# EAGLE design kegboard-coaster-alt (EAGLE 6.4)
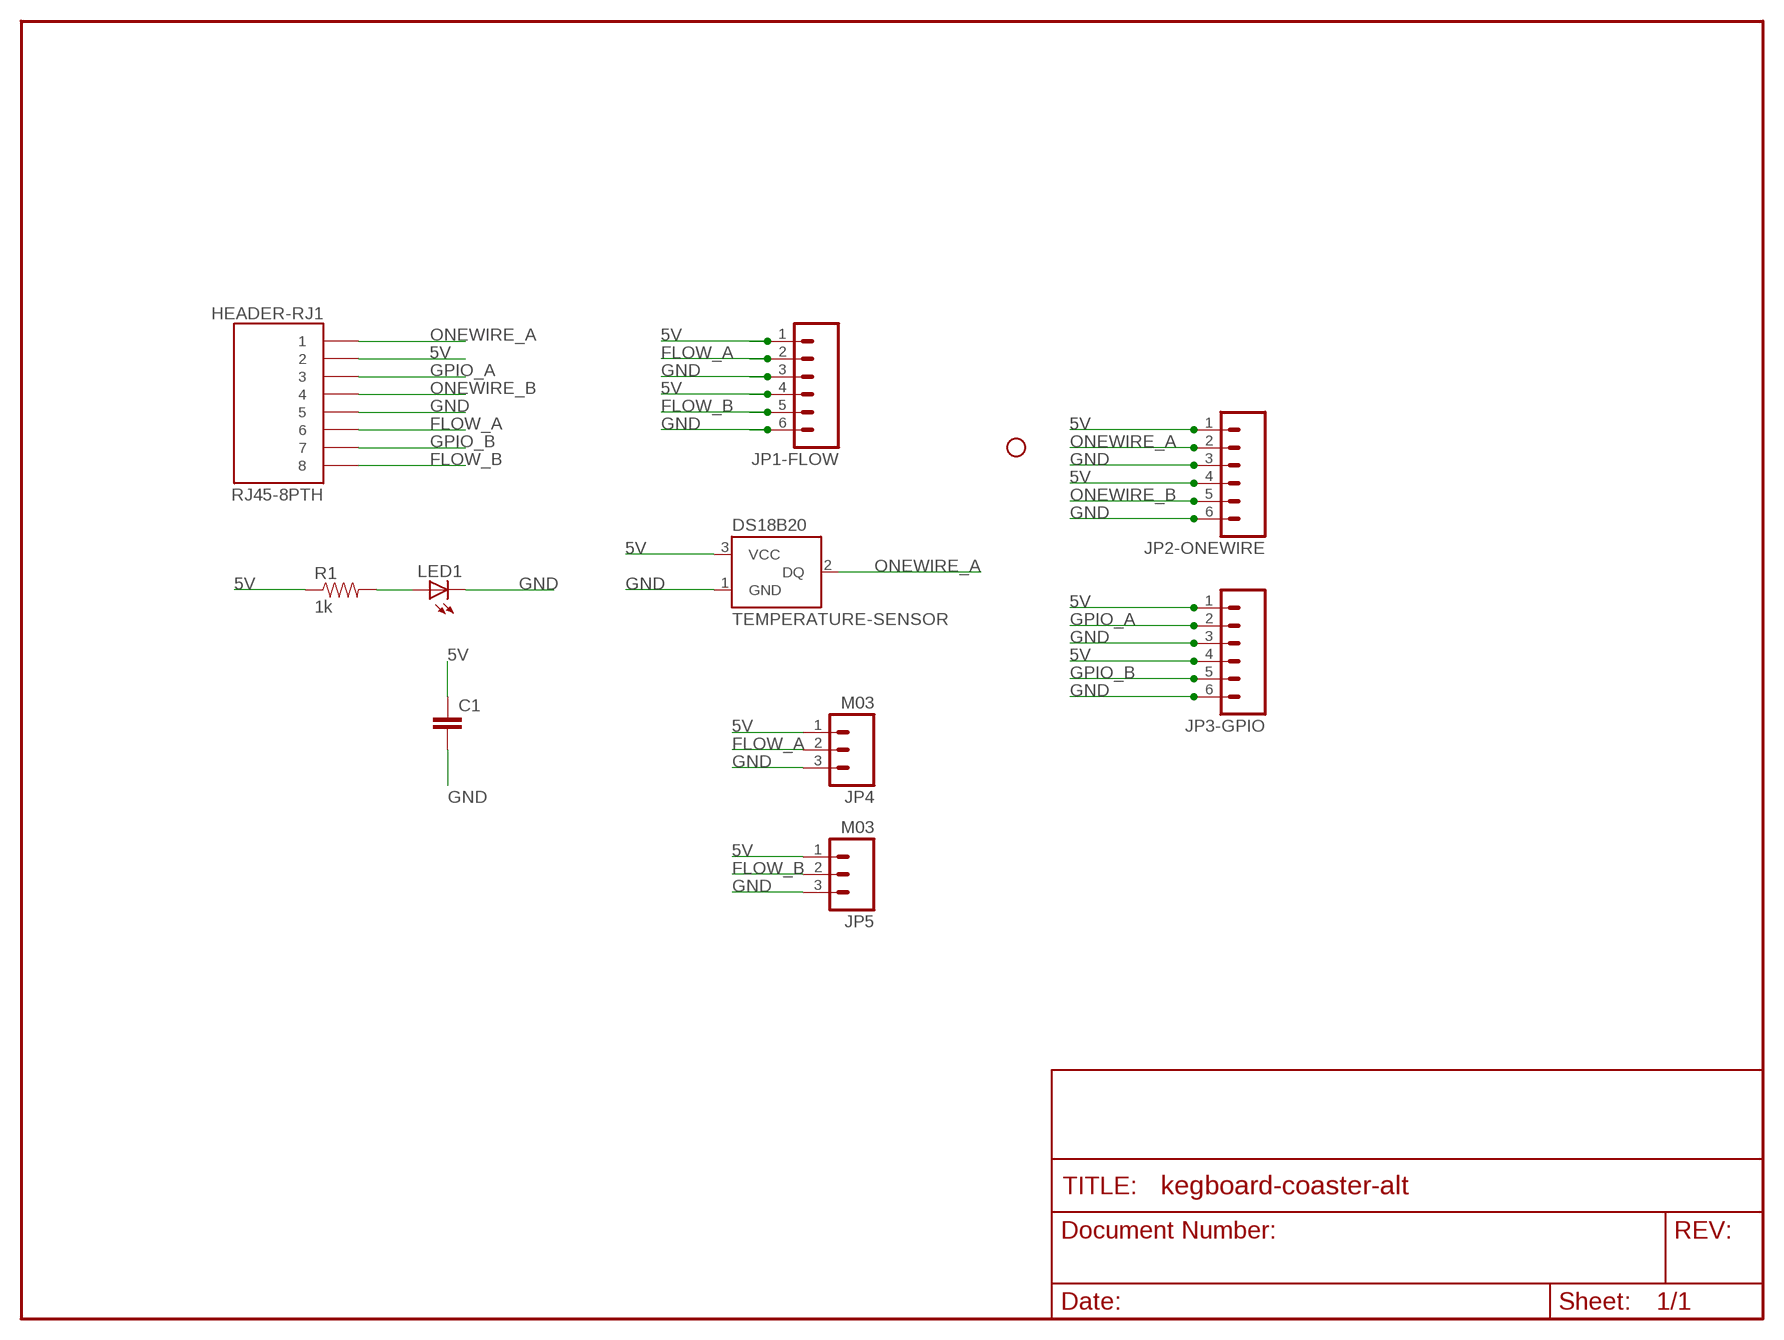
[diagram p0: schematic, sheet 1]

## Parts
C1  CAPPTH2  [CAP-PTH-SMALL2]
HEADER-RJ1  RJ45-8PTH  [RJ45-8]
JP1-FLOW  M063.5MM-6  [SCREWTERMINAL-3.5MM-6]
JP2  STAND-OFF  [STAND-OFF]
JP2-ONEWIRE  M063.5MM-6  [SCREWTERMINAL-3.5MM-6]
JP3-GPIO  M063.5MM-6  [SCREWTERMINAL-3.5MM-6]
JP4  M03  [53324-0360]
JP5  M03  [53324-0360]
LED1  LED3MM  [LED3MM]
R1  1k  RESISTORPTH1  [AXIAL-0.3]
U$1  TEMPERATURE-SENSOR  [TO-92]

## Nets
5V: C1.1 HEADER-RJ1.2 JP1-FLOW.1 JP1-FLOW.4 JP2-ONEWIRE.1 JP2-ONEWIRE.4 JP3-GPIO.1 JP3-GPIO.4 JP4.1 JP5.1 R1.P$1 U$1.3(VCC)
FLOW_A: HEADER-RJ1.6 JP1-FLOW.2 JP4.2
FLOW_B: HEADER-RJ1.8 JP1-FLOW.5 JP5.2
GND: C1.2 HEADER-RJ1.5 JP1-FLOW.3 JP1-FLOW.6 JP2-ONEWIRE.3 JP2-ONEWIRE.6 JP3-GPIO.3 JP3-GPIO.6 JP4.3 JP5.3 LED1.K(C) U$1.1(GND)
GPIO_A: HEADER-RJ1.3 JP3-GPIO.2
GPIO_B: HEADER-RJ1.7 JP3-GPIO.5
N$1: LED1.A R1.P$2
ONEWIRE_A: HEADER-RJ1.1 JP2-ONEWIRE.2 U$1.2(DQ)
ONEWIRE_B: HEADER-RJ1.4 JP2-ONEWIRE.5

## Library data of the parts
C1 = SparkFun-20100412:CAP: Capacitor Standard 0603 ceramic capacitor, and 0.1" leaded capacitor.
HEADER-RJ1 = SparkFun:RJ45-8: RJ45 Jack Simple RJ45, 8-pin connection - connector for common Cat5, Cat5e, and Cat6 Ethernet cables. Footprint not yet proven in production. Connector sku is PRT-00643; Breakout PCB sku is BOB-00716.
JP1-FLOW JP2-ONEWIRE JP3-GPIO = SparkFun:M06: Header 6 Standard 6-pin 0.1" header. Use with straight break away headers (SKU : PRT-00116), right angle break away headers (PRT-00553), swiss pins (PRT-00743), machine pins (PRT-00117), and female headers (PRT-00115). Molex polarized connector foot print use with SKU : PRT-08094 with associated crimp pins and housings. NOTES ON THE VARIANTS LOCK and LOCK_LONGPADS... This footprint was designed to help hold the alignment of a through-hole component (i.e. 6-pin header) while soldering it into place. You may notice that each hole has been shifted either up or down by 0.005 of an inch from it's more standard position (which is a perfectly straight line). This slight alteration caused the pins (the squares in the middle) to touch the edges of the holes. Because they are alternating, it causes a "brace" to hold the component in place. 0.005 has proven to be the perfect amount of "off-center" position when using our standard breakaway headers. Although looks a little odd when you look at the bare footprint, once you have a header in there, the alteration is very hard to notice. Also, if you push a header all the way into place, it is covered up entirely on the bottom side. This idea of altering the position of holes to aid alignment will be further integrated into the Sparkfun Library for other footprints. It can help hold any component with 3 or more connection pins.
JP2 = SparkFun-20100412:STAND-OFF: Stand Off This is the mechanical footprint for a #4 phillips button head screw. Use the keepout ring to avoid running the screw head into surrounding components. SKU : PRT-00447
JP4 JP5 = mikey-molex:M03
LED1 = SparkFun:LED: LEDs Standard schematic elements and footprints for 5mm, 3mm, 1206, and 0603 sized LEDs. 5mm - Spark Fun Electronics SKU : COM-00529 (and others)
R1 = SparkFun:RESISTOR: Resistor Basic schematic elements and footprints for 0603, 1206, and PTH 1/10th watt (small) resistors.
U$1 = geoffculp:TEMPERATURE-SENSOR

## Board
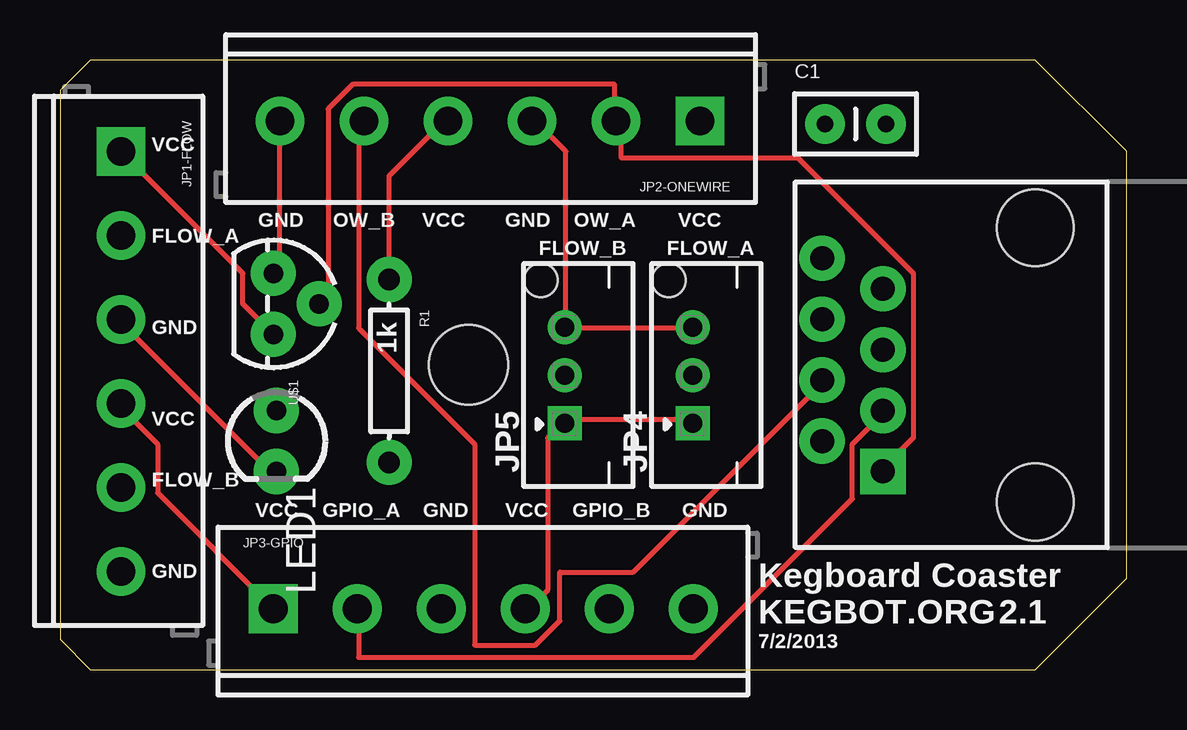
[diagram p1: board, top side]
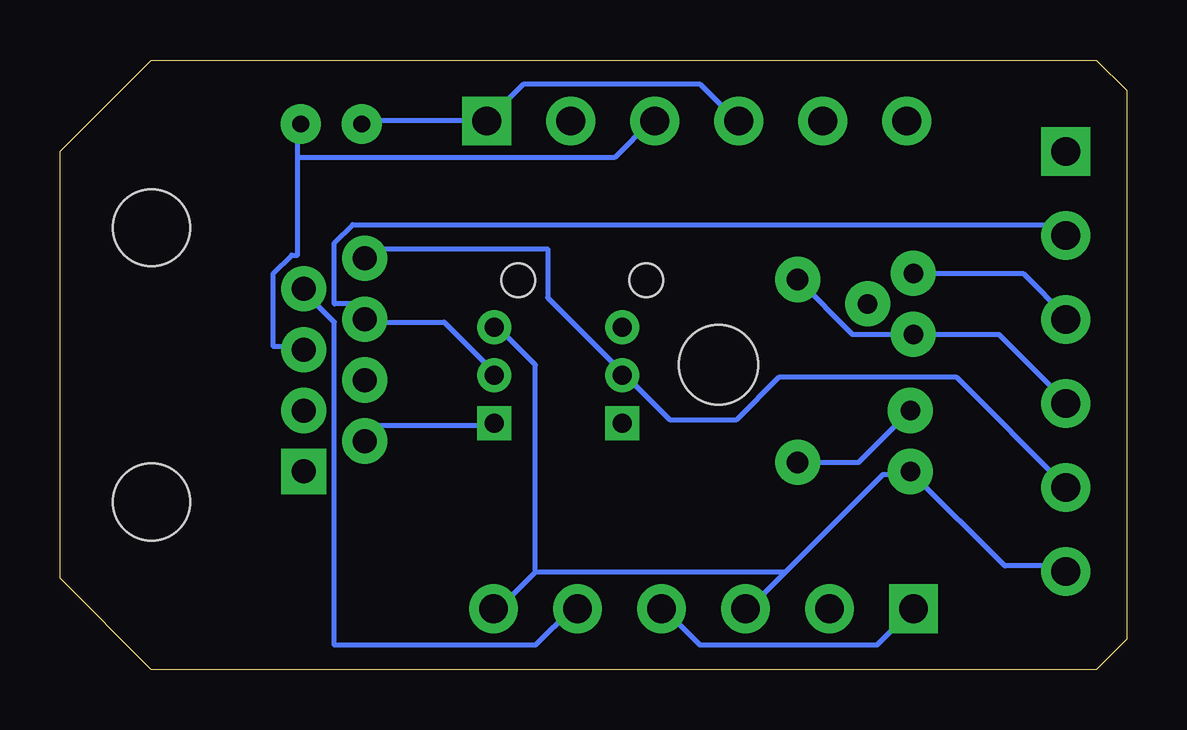
[diagram p2: board, bottom side, seen from below]

Size 44.45 x 25.4 mm. Coordinates in mm from the lower left corner, seen from the top.
Outline: 0,1.27 1.27,0 40.64,0 44.45,3.81 44.45,21.59 40.64,25.4 1.27,25.4 0,24.13 0,1.27
Copper layers (1*16): Top 0.035mm / dielectric 1.5mm / Bottom 0.035mm
Design rules "SparkFun": minimum track width 8mil, minimum drill 20mil, track to track 8mil, track to pad 8mil, pad to pad 8mil, via to via 8mil, smd to smd 8mil, copper to edge 10mil, drill to drill 8mil, minimum pad ring 12mil, minimum via ring 10mil, stop-mask expansion 4mil, vias tented up to drill 25mil, thermal gap 10mil

### Footprints (pad centres in the part's own frame; a part is rotated, then mirrored left to right if it is on the bottom)
CAP-PTH-SMALL2 = drill 0.7 pad 1.651: 1 0,0; 2 2.54,0
RJ45-8 = drill 1 pad 1.88 square: 1 -4.445,6.35 | drill 1 pad 1.88: 2 -3.175,8.89; 3 -1.905,6.35; 4 -0.635,8.89; 5 0.635,6.35; 6 1.905,8.89; 7 3.175,6.35; 8 4.445,8.89 | hole 3.2: -5.715,0; 5.715,0
SCREWTERMINAL-3.5MM-6 = drill 1.2 pad 2.032 square: 1 0,0 | drill 1.2 pad 2.032: 2 3.5,0; 3 7,0; 4 10.5,0; 5 14,0; 6 17.5,0
STAND-OFF = hole 3.302: 0,0
53324-0360 = drill 0.8 square: 1 2.65,2.85 | drill 0.8: 2 4.65,2.85; 3 6.65,2.85 | hole 1.4: 8.6,3.85
LED3MM = drill 0.813 pad 1.88: A -1.27,0; K 1.27,0
AXIAL-0.3 = drill 0.9 pad 1.88: P$1 -3.81,0; P$2 3.81,0
TO-92 = drill 0.813 pad 1.88: 1 -1.27,0; 2 0,1.905; 3 1.27,0

### Placement (x,y rotation side)
C1  31.88,22.73 0 top
HEADER-RJ1  40.64,12.7 90 top
JP1-FLOW  2.54,21.59 270 top
JP2  17.02,12.7 0 top
JP2-ONEWIRE  26.67,22.86 180 top
JP3-GPIO  8.89,2.54 0 top
JP4  29.21,7.62 90 top
JP5  23.88,7.62 90 top
LED1  9.02,9.53 270 top
R1  13.72,12.45 270 top
U$1  8.89,15.24 270 top

### Tracks (layer width: path | path; a pad name or v marks a point on that pad's centre or on a via)
5V
  Top 0.203: JP4.1 26.16,10.41 21.08,10.41 JP5.1 20.83,10.16 20.32,9.65 20.32,3.3 19.56,2.54 JP3-GPIO.4 | JP1-FLOW.1 7.62,16.51 7.62,15.24 U$1.3 | JP3-GPIO.1 4.06,7.37 4.06,9.4 2.54,10.92 JP1-FLOW.4 | R1.P$1 13.72,20.57 16,22.86 JP2-ONEWIRE.4
  Bottom 0.203: HEADER-RJ1.2 31.75,9.65 31.24,10.16 26.42,10.16 JP4.1 | C1.1 31.75,22.86 JP2-ONEWIRE.1 25.15,24.38 17.78,24.38 16.26,22.86 JP2-ONEWIRE.4 | R1.P$1 11.43,13.97 U$1.3 5.33,13.97 2.54,11.18 JP1-FLOW.4 | JP3-GPIO.1 10.41,1.02 17.78,1.02 19.3,2.54 JP3-GPIO.4
FLOW_A
  Bottom 0.203: JP4.2 26.42,12.45 28.45,14.48 31.75,14.48 HEADER-RJ1.6 31.75,14.73 32.26,15.24 33.02,15.24 33.02,17.78 32.26,18.54 2.79,18.54 2.54,18.29 JP1-FLOW.2
FLOW_B
  Bottom 0.203: HEADER-RJ1.8 31.75,17.27 31.5,17.53 24.13,17.53 24.13,15.49 21.08,12.45 JP5.2 20.83,12.19 19.05,10.41 16.26,10.41 14.48,12.19 7.11,12.19 2.54,7.62 JP1-FLOW.5
GND
  Top 0.203: JP4.3 26.16,14.22 21.08,14.22 JP5.3 21.08,14.48 21.08,21.59 19.81,22.86 JP2-ONEWIRE.3 | U$1.1 9.14,16.76 9.14,22.86 JP2-ONEWIRE.6 | JP1-FLOW.3 2.54,14.48 8.89,8.13 LED1.K
  Bottom 0.203: 34.54,21.34 34.54,17.27 34.8,17.27 35.56,16.51 35.56,13.46 34.29,13.46 HEADER-RJ1.5 | 34.54,21.34 34.54,22.61 C1.2 | 34.54,21.34 21.34,21.34 19.81,22.86 JP2-ONEWIRE.3 | U$1.1 4.32,16.51 2.54,14.73 JP1-FLOW.3 | JP1-FLOW.6 2.54,4.32 5.08,4.32 8.89,8.13 LED1.K 9.14,8.13 10.16,8.13 14.22,4.06 | 14.22,4.06 15.75,2.54 JP3-GPIO.3 | 24.64,4.06 26.16,2.54 JP3-GPIO.6 | 14.22,4.06 24.64,4.06 | 24.64,4.06 24.64,12.7 26.16,14.22 JP4.3
GPIO_A
  Top 0.203: HEADER-RJ1.3 34.29,10.67 33.02,9.4 33.02,7.11 26.42,0.51 12.45,0.51 12.45,2.54 JP3-GPIO.2
GPIO_B
  Bottom 0.203: HEADER-RJ1.7 34.29,15.75 33.02,14.48 33.02,1.02 24.64,1.02 23.11,2.54 JP3-GPIO.5
N$1
  Bottom 0.203: R1.P$2 11.18,8.64 9.14,10.67 LED1.A
ONEWIRE_A
  Top 0.203: U$1.2 10.92,15.24 11.18,15.49 11.18,23.37 12.19,24.38 23.11,24.38 23.11,22.86 JP2-ONEWIRE.2 23.37,22.86 23.37,21.34 30.73,21.34 35.56,16.51 35.56,9.65 34.29,8.38 HEADER-RJ1.1
ONEWIRE_B
  Top 0.203: HEADER-RJ1.4 31.75,11.94 23.88,4.06 20.83,4.06 20.83,2.03 19.81,1.02 17.27,1.02 17.27,9.4 12.45,14.22 12.45,22.86 JP2-ONEWIRE.5

### Text on the board
tPlace: VCC | GND | OW_B | VCC | GND | OW_A | VCC | FLOW_A | FLOW_B | FLOW_A | GND | VCC | FLOW_B | VCC | GPIO_A | GND | VCC | GPIO_B | GND | GND | Kegboard Coaster | KEGBOT.ORG | 2.1 | 7/2/2013